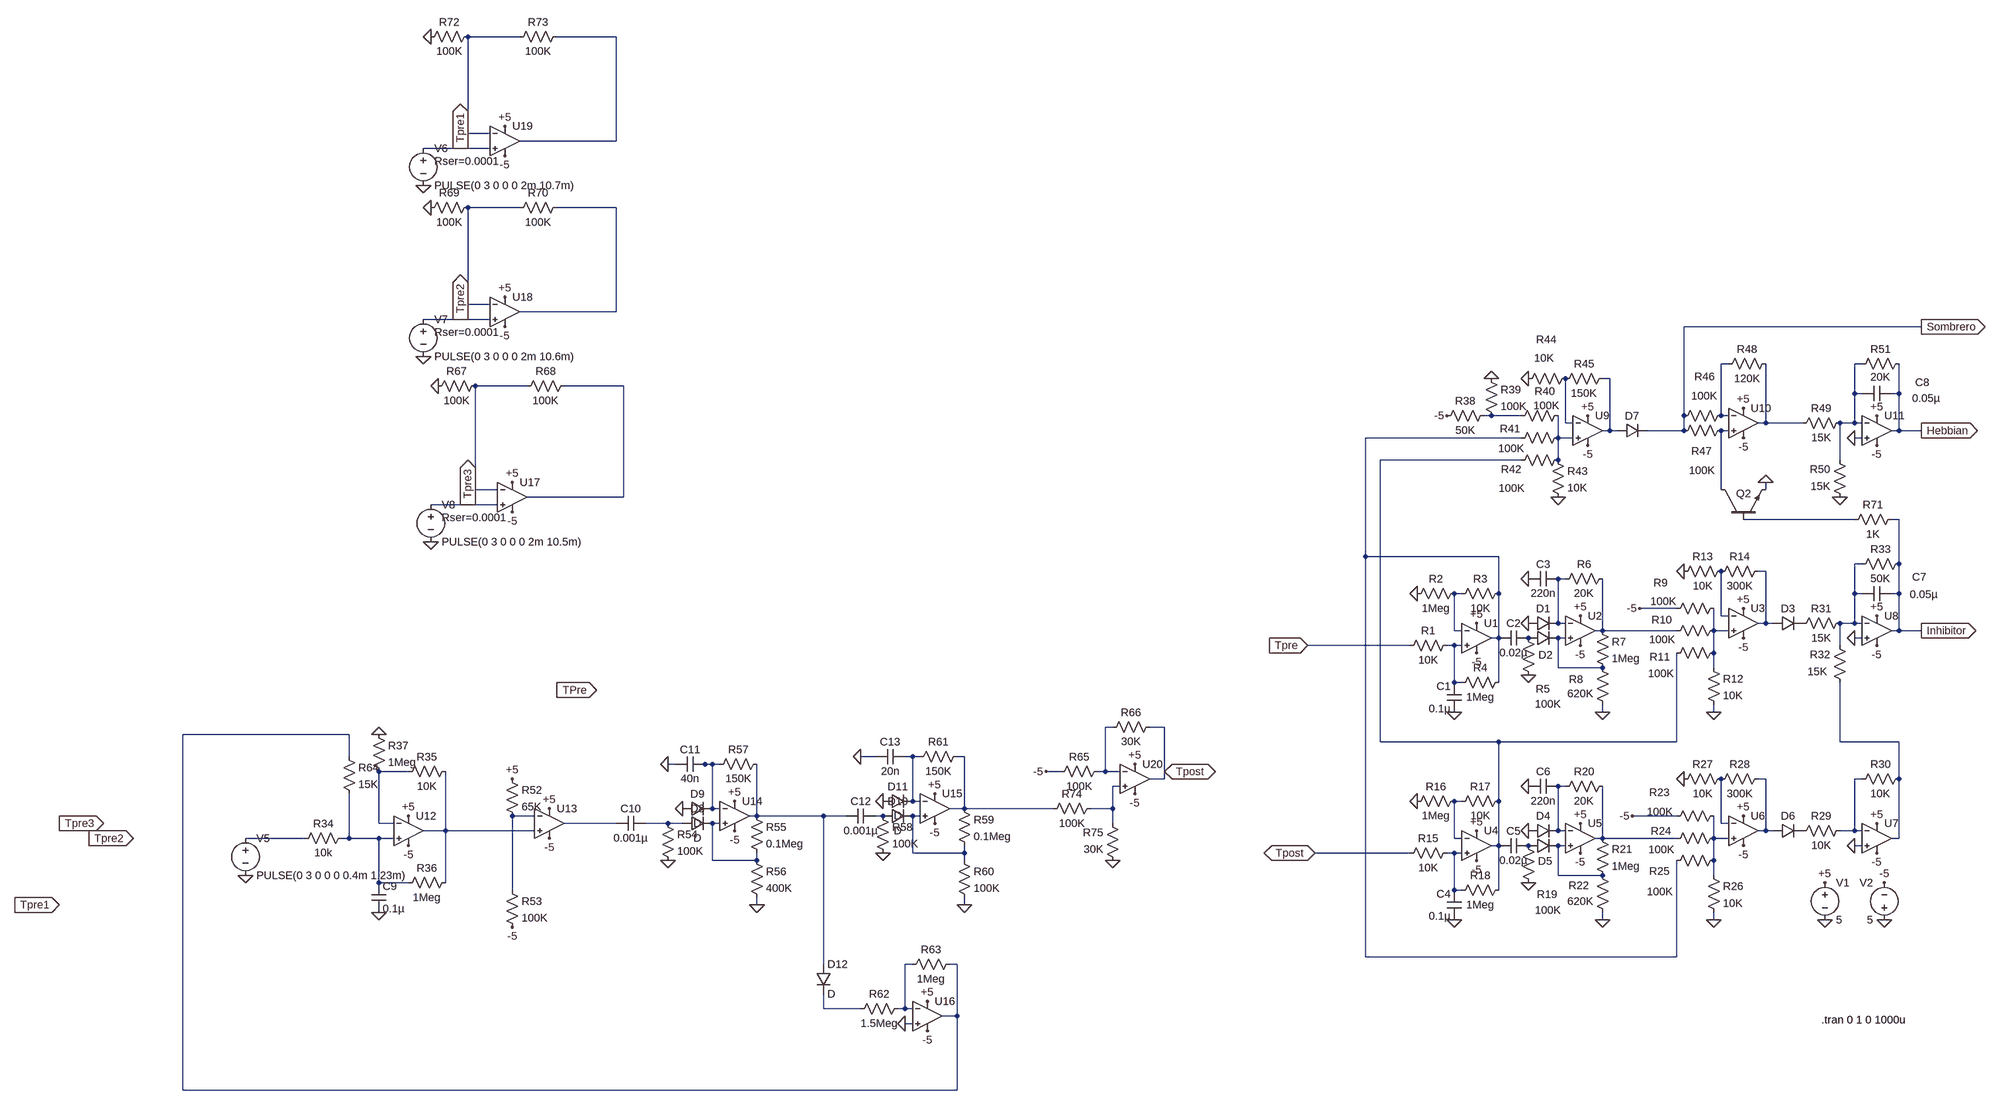
[diagram p0: schematic Stable_operation.asc]
Stable_operation.asc, the LTspice schematic file:
Version 4
SHEET 1 2784 1988
WIRE -2000 -1328 -2112 -1328
WIRE -1792 -1328 -1920 -1328
WIRE -2112 -1104 -2112 -1328
WIRE -2064 -1104 -2112 -1104
WIRE -1792 -1088 -1792 -1328
WIRE -1792 -1088 -2000 -1088
WIRE -2128 -1072 -2208 -1072
WIRE -2064 -1072 -2128 -1072
WIRE -2000 -944 -2112 -944
WIRE -1792 -944 -1920 -944
WIRE -2112 -720 -2112 -944
WIRE -2064 -720 -2112 -720
WIRE -1792 -704 -1792 -944
WIRE -1792 -704 -2000 -704
WIRE -2128 -688 -2208 -688
WIRE -2064 -688 -2128 -688
WIRE 1184 -672 672 -672
WIRE 768 -592 752 -592
WIRE 1056 -592 1040 -592
WIRE 512 -560 496 -560
WIRE -1984 -544 -2096 -544
WIRE -1776 -544 -1904 -544
WIRE 1040 -528 1040 -592
WIRE 1056 -528 1040 -528
WIRE 1136 -528 1136 -592
WIRE 1136 -528 1120 -528
WIRE 256 -480 240 -480
WIRE 320 -480 256 -480
WIRE 672 -480 672 -672
WIRE 752 -480 752 -592
WIRE 768 -480 752 -480
WIRE 416 -464 416 -560
WIRE 432 -464 416 -464
WIRE 848 -464 848 -592
WIRE 848 -464 832 -464
WIRE 928 -464 848 -464
WIRE 1040 -464 1040 -528
WIRE 1040 -464 1008 -464
WIRE 1056 -464 1040 -464
WIRE 512 -448 512 -560
WIRE 512 -448 496 -448
WIRE 528 -448 512 -448
WIRE 672 -448 672 -480
WIRE 672 -448 592 -448
WIRE 768 -448 752 -448
WIRE 1136 -448 1136 -528
WIRE 1136 -448 1120 -448
WIRE 1184 -448 1136 -448
WIRE 320 -432 -16 -432
WIRE 400 -432 400 -480
WIRE 432 -432 400 -432
WIRE 1056 -432 1040 -432
WIRE 320 -384 16 -384
WIRE 400 -384 400 -432
WIRE 1008 -384 1008 -464
WIRE -2096 -320 -2096 -544
WIRE -2048 -320 -2096 -320
WIRE 752 -320 752 -448
WIRE 848 -320 848 -336
WIRE -1776 -304 -1776 -544
WIRE -1776 -304 -1984 -304
WIRE -2112 -288 -2192 -288
WIRE -2048 -288 -2112 -288
WIRE 1040 -256 800 -256
WIRE 1136 -256 1120 -256
WIRE -16 -176 -16 -432
WIRE 272 -176 -16 -176
WIRE 1056 -160 1040 -160
WIRE 1136 -160 1136 -256
WIRE 848 -144 832 -144
WIRE 416 -128 400 -128
WIRE 192 -96 176 -96
WIRE 272 -96 272 -176
WIRE 1040 -96 1040 -160
WIRE 1056 -96 1040 -96
WIRE 1136 -96 1136 -160
WIRE 1136 -96 1120 -96
WIRE 656 -64 576 -64
WIRE 752 -48 752 -144
WIRE 768 -48 752 -48
WIRE 400 -32 400 -128
WIRE 416 -32 400 -32
WIRE 848 -32 848 -144
WIRE 848 -32 832 -32
WIRE 864 -32 848 -32
WIRE 1040 -32 1040 -96
WIRE 1040 -32 1008 -32
WIRE 1056 -32 1040 -32
WIRE 176 -16 176 -96
WIRE 192 -16 176 -16
WIRE 496 -16 496 -128
WIRE 496 -16 480 -16
WIRE 656 -16 496 -16
WIRE 736 -16 736 -64
WIRE 768 -16 736 -16
WIRE 1136 -16 1136 -96
WIRE 1136 -16 1120 -16
WIRE 1184 -16 1136 -16
WIRE 272 0 272 -96
WIRE 272 0 256 0
WIRE 416 0 400 0
WIRE 1056 0 1040 0
WIRE 80 16 -224 16
WIRE 176 16 160 16
WIRE 192 16 176 16
WIRE 1008 16 1008 -32
WIRE 736 32 736 -16
WIRE 400 64 400 0
WIRE 496 64 400 64
WIRE 736 64 736 32
WIRE 176 96 176 16
WIRE 192 96 176 96
WIRE 272 96 272 0
WIRE 496 160 496 144
WIRE 736 160 736 144
WIRE -720 192 -736 192
WIRE -608 192 -640 192
WIRE -2368 208 -2736 208
WIRE 16 224 16 -384
WIRE 272 224 16 224
WIRE 656 224 656 32
WIRE 656 224 272 224
WIRE 1008 224 1008 96
WIRE 1136 224 1008 224
WIRE -2368 256 -2368 208
WIRE -1232 256 -1264 256
WIRE -1152 256 -1168 256
WIRE -1136 256 -1152 256
WIRE -1040 256 -1056 256
WIRE -1664 272 -1680 272
WIRE -1600 272 -1616 272
WIRE -1584 272 -1600 272
WIRE -1568 272 -1584 272
WIRE -2240 288 -2304 288
WIRE -832 288 -864 288
WIRE -736 288 -736 192
WIRE -736 288 -752 288
WIRE -704 288 -736 288
WIRE -608 288 -608 192
WIRE -608 304 -608 288
WIRE -608 304 -640 304
WIRE 848 304 832 304
WIRE 1056 304 1040 304
WIRE 1136 304 1136 224
WIRE -704 320 -720 320
WIRE 416 320 400 320
WIRE -1152 352 -1152 256
WIRE -1136 352 -1152 352
WIRE 192 352 176 352
WIRE 272 352 272 224
WIRE -1584 368 -1584 272
WIRE -1568 368 -1584 368
WIRE -1040 368 -1040 256
WIRE -1040 368 -1072 368
WIRE -848 368 -1040 368
WIRE -720 368 -720 320
WIRE -720 368 -768 368
WIRE -1968 384 -2016 384
WIRE -1488 384 -1488 272
WIRE -1488 384 -1504 384
WIRE -1344 384 -1488 384
WIRE -1296 384 -1344 384
WIRE -1216 384 -1232 384
WIRE -1136 384 -1152 384
WIRE 656 384 560 384
WIRE -2304 400 -2304 288
WIRE -2272 400 -2304 400
WIRE -1792 400 -1904 400
WIRE -1680 400 -1728 400
WIRE -1648 400 -1680 400
WIRE -1568 400 -1584 400
WIRE -720 400 -720 368
WIRE 752 400 752 304
WIRE 768 400 752 400
WIRE -2160 416 -2160 288
WIRE -2160 416 -2208 416
WIRE -1968 416 -2160 416
WIRE 400 416 400 320
WIRE 416 416 400 416
WIRE 848 416 848 304
WIRE 848 416 832 416
WIRE 864 416 848 416
WIRE 1040 416 1040 304
WIRE 1040 416 1008 416
WIRE 1056 416 1040 416
WIRE -2464 432 -2592 432
WIRE -2368 432 -2368 336
WIRE -2368 432 -2384 432
WIRE -2304 432 -2368 432
WIRE -2272 432 -2304 432
WIRE 176 432 176 352
WIRE 192 432 176 432
WIRE 496 432 496 320
WIRE 496 432 480 432
WIRE 656 432 496 432
WIRE 736 432 736 384
WIRE 768 432 736 432
WIRE 1136 432 1136 304
WIRE 1136 432 1120 432
WIRE 272 448 272 352
WIRE 272 448 256 448
WIRE 416 448 400 448
WIRE 1056 448 1040 448
WIRE -1152 464 -1152 384
WIRE -1040 464 -1040 448
WIRE -1040 464 -1152 464
WIRE 80 464 -208 464
WIRE 176 464 160 464
WIRE 192 464 176 464
WIRE -1584 480 -1584 400
WIRE -1488 480 -1488 464
WIRE -1488 480 -1584 480
WIRE -1040 480 -1040 464
WIRE 736 480 736 432
WIRE 400 512 400 448
WIRE 496 512 400 512
WIRE 736 512 736 480
WIRE -2304 528 -2304 432
WIRE -2240 528 -2304 528
WIRE -2160 528 -2160 416
WIRE -2016 544 -2016 384
WIRE 176 544 176 464
WIRE 192 544 176 544
WIRE 272 544 272 448
WIRE -1488 576 -1488 560
WIRE -1040 576 -1040 560
WIRE 496 608 496 592
WIRE 736 608 736 592
WIRE -16 688 -16 -176
WIRE 656 688 656 480
WIRE 656 688 -16 688
WIRE -1344 704 -1344 384
WIRE -1152 704 -1168 704
WIRE -1056 704 -1072 704
WIRE -1344 800 -1344 768
WIRE -1264 800 -1344 800
WIRE -1168 800 -1168 704
WIRE -1168 800 -1184 800
WIRE -1152 800 -1168 800
WIRE -1056 816 -1056 704
WIRE -1056 816 -1088 816
WIRE -1152 832 -1168 832
WIRE -2736 976 -2736 208
WIRE -1056 976 -1056 816
WIRE -1056 976 -2736 976
FLAG 800 -64 +5
FLAG 800 0 -5
FLAG 224 -32 +5
FLAG 224 32 -5
FLAG 448 -48 +5
FLAG 448 16 -5
FLAG 336 -32 0
FLAG 336 -128 0
FLAG 336 80 0
FLAG 672 -144 0
FLAG 576 -64 -5
FLAG 448 400 +5
FLAG 448 464 -5
FLAG 336 416 0
FLAG 336 320 0
FLAG 336 528 0
FLAG 496 608 0
FLAG 496 160 0
FLAG 800 384 +5
FLAG 800 448 -5
FLAG 672 304 0
FLAG 560 384 -5
FLAG 176 160 0
FLAG 96 -96 0
FLAG 224 416 +5
FLAG 224 480 -5
FLAG 176 608 0
FLAG 96 352 0
FLAG 1088 -48 +5
FLAG 1088 16 -5
FLAG 1088 400 +5
FLAG 1088 464 -5
FLAG 1040 448 0
FLAG 1040 0 0
FLAG 736 160 0
FLAG 736 608 0
FLAG 1184 -16 Inhibitor
IOPIN 1184 -16 Out
FLAG 464 -480 +5
FLAG 464 -416 -5
FLAG 336 -560 0
FLAG 256 -560 0
FLAG 800 -496 +5
FLAG 800 -432 -5
FLAG 160 -480 -5
FLAG 1088 -480 +5
FLAG 1088 -416 -5
FLAG 1040 -432 0
FLAG 1008 -304 0
FLAG 848 -336 0
FLAG 1184 -448 Hebbian
IOPIN 1184 -448 Out
FLAG 1184 -672 Sombrero
IOPIN 1184 -672 Out
FLAG 976 608 0
FLAG 1104 608 0
FLAG 1104 528 -5
FLAG 976 528 +5
FLAG -208 464 Tpost
IOPIN -208 464 BiDir
FLAG 400 -304 0
FLAG -2304 208 0
FLAG -2304 592 0
FLAG -1680 480 0
FLAG -1488 576 0
FLAG -1680 272 0
FLAG -1648 368 0
FLAG -1216 464 0
FLAG -1040 576 0
FLAG -1264 256 0
FLAG -1216 352 0
FLAG -1168 832 0
FLAG -2592 512 0
FLAG -2240 384 +5
FLAG -1936 368 +5
FLAG -1536 352 +5
FLAG -1104 336 +5
FLAG -1120 784 +5
FLAG -1920 112 TPre
IOPIN -1920 112 Out
FLAG -1936 432 -5
FLAG -2240 448 -5
FLAG -1536 416 -5
FLAG -1104 400 -5
FLAG -1120 848 -5
FLAG -2016 624 -5
FLAG -2016 304 +5
FLAG -2016 -336 +5
FLAG -2016 -272 -5
FLAG -2176 -544 0
FLAG -2112 -288 Tpre3
IOPIN -2112 -288 Out
FLAG -2032 -736 +5
FLAG -2032 -672 -5
FLAG -2192 -944 0
FLAG -2128 -688 Tpre2
IOPIN -2128 -688 Out
FLAG -2032 -1120 +5
FLAG -2032 -1056 -5
FLAG -2192 -1328 0
FLAG -2128 -1072 Tpre1
IOPIN -2128 -1072 Out
FLAG -2864 432 Tpre2
IOPIN -2864 432 In
FLAG -3024 576 Tpre1
IOPIN -3024 576 In
FLAG -2928 400 Tpre3
IOPIN -2928 400 In
FLAG -224 16 Tpre
IOPIN -224 16 In
FLAG -2208 -992 0
FLAG -2208 -608 0
FLAG -2192 -208 0
FLAG -672 272 +5
FLAG -672 336 -5
FLAG -720 480 0
FLAG -608 288 Tpost
IOPIN -608 288 BiDir
FLAG -864 288 -5
SYMBOL Opamps\\UniversalOpamp2 800 -32 R0
SYMATTR InstName U3
SYMBOL res 848 -160 R90
WINDOW 0 0 56 VBottom 2
WINDOW 3 32 56 VTop 2
SYMATTR InstName R14
SYMATTR Value 300K
SYMBOL res 720 48 R0
SYMATTR InstName R12
SYMATTR Value 10K
SYMBOL res 752 -32 R90
WINDOW 0 8 128 VBottom 2
WINDOW 3 20 127 VTop 2
SYMATTR InstName R10
SYMATTR Value 100K
SYMBOL Opamps\\UniversalOpamp2 224 0 R0
SYMATTR InstName U1
SYMBOL cap 192 160 R180
WINDOW 0 24 56 Left 2
WINDOW 3 24 8 Left 2
SYMATTR InstName C1
SYMATTR Value 0.1µ
SYMBOL res 176 0 R90
WINDOW 0 0 56 VBottom 2
WINDOW 3 32 56 VTop 2
SYMATTR InstName R1
SYMATTR Value 10K
SYMBOL res 176 448 R90
WINDOW 0 0 56 VBottom 2
WINDOW 3 32 56 VTop 2
SYMATTR InstName R15
SYMATTR Value 10K
SYMBOL res 288 -112 R90
WINDOW 0 0 56 VBottom 2
WINDOW 3 32 56 VTop 2
SYMATTR InstName R3
SYMATTR Value 10K
SYMBOL res 752 16 R90
WINDOW 0 40 132 VBottom 2
WINDOW 3 45 130 VTop 2
SYMATTR InstName R11
SYMATTR Value 100K
SYMBOL Opamps\\UniversalOpamp2 448 -16 R0
SYMATTR InstName U2
SYMBOL diode 336 -16 R270
WINDOW 0 32 32 VTop 2
WINDOW 3 0 32 Invisible 2
SYMATTR InstName D1
SYMBOL diode 336 16 R270
WINDOW 0 -36 37 VTop 2
WINDOW 3 0 32 Invisible 2
SYMATTR InstName D2
SYMBOL res 480 -32 R0
SYMATTR InstName R7
SYMATTR Value 1Meg
SYMBOL res 512 160 R180
WINDOW 0 58 71 Left 2
WINDOW 3 36 40 Left 2
SYMATTR InstName R8
SYMATTR Value 620K
SYMBOL res 320 -16 R0
WINDOW 0 32 126 Left 2
WINDOW 3 30 158 Left 2
SYMATTR InstName R5
SYMATTR Value 100K
SYMBOL cap 336 -16 R90
WINDOW 0 0 32 VBottom 2
WINDOW 3 32 32 VTop 2
SYMATTR InstName C2
SYMATTR Value 0.02µ
SYMBOL res 512 -144 R90
WINDOW 0 0 56 VBottom 2
WINDOW 3 32 56 VTop 2
SYMATTR InstName R6
SYMATTR Value 20K
SYMBOL cap 400 -144 R90
WINDOW 0 0 32 VBottom 2
WINDOW 3 32 32 VTop 2
SYMATTR InstName C3
SYMATTR Value 220n
SYMBOL res 656 -128 R270
WINDOW 0 32 56 VTop 2
WINDOW 3 0 56 VBottom 2
SYMATTR InstName R13
SYMATTR Value 10K
SYMBOL diode 864 -16 R270
WINDOW 0 32 32 VTop 2
WINDOW 3 0 32 Invisible 2
SYMATTR InstName D3
SYMBOL res 752 -80 R90
WINDOW 0 -24 131 VBottom 2
WINDOW 3 -15 125 VTop 2
SYMATTR InstName R9
SYMATTR Value 100K
SYMBOL Opamps\\UniversalOpamp2 448 432 R0
SYMATTR InstName U5
SYMBOL diode 336 432 R270
WINDOW 0 32 32 VTop 2
WINDOW 3 0 32 Invisible 2
SYMATTR InstName D4
SYMBOL diode 336 464 R270
WINDOW 0 -33 36 VTop 2
WINDOW 3 0 32 Invisible 2
SYMATTR InstName D5
SYMBOL res 480 416 R0
SYMATTR InstName R21
SYMATTR Value 1Meg
SYMBOL res 512 608 R180
WINDOW 0 45 74 Left 2
WINDOW 3 36 40 Left 2
SYMATTR InstName R22
SYMATTR Value 620K
SYMBOL res 320 432 R0
WINDOW 0 34 121 Left 2
WINDOW 3 30 155 Left 2
SYMATTR InstName R19
SYMATTR Value 100K
SYMBOL res 512 304 R90
WINDOW 0 0 56 VBottom 2
WINDOW 3 32 56 VTop 2
SYMATTR InstName R20
SYMATTR Value 20K
SYMBOL cap 400 304 R90
WINDOW 0 0 32 VBottom 2
WINDOW 3 32 32 VTop 2
SYMATTR InstName C6
SYMATTR Value 220n
SYMBOL cap 336 432 R90
WINDOW 0 0 32 VBottom 2
WINDOW 3 32 32 VTop 2
SYMATTR InstName C5
SYMATTR Value 0.02µ
SYMBOL Opamps\\UniversalOpamp2 800 416 R0
SYMATTR InstName U6
SYMBOL res 848 288 R90
WINDOW 0 0 56 VBottom 2
WINDOW 3 32 56 VTop 2
SYMATTR InstName R28
SYMATTR Value 300K
SYMBOL res 720 496 R0
SYMATTR InstName R26
SYMATTR Value 10K
SYMBOL res 752 416 R90
WINDOW 0 16 130 VBottom 2
WINDOW 3 25 129 VTop 2
SYMATTR InstName R24
SYMATTR Value 100K
SYMBOL res 752 464 R90
WINDOW 0 55 133 VBottom 2
WINDOW 3 68 132 VTop 2
SYMATTR InstName R25
SYMATTR Value 100K
SYMBOL res 656 320 R270
WINDOW 0 32 56 VTop 2
WINDOW 3 0 56 VBottom 2
SYMATTR InstName R27
SYMATTR Value 10K
SYMBOL diode 864 432 R270
WINDOW 0 32 32 VTop 2
WINDOW 3 0 32 Invisible 2
SYMATTR InstName D6
SYMBOL res 752 368 R90
WINDOW 0 -19 133 VBottom 2
WINDOW 3 -9 132 VTop 2
SYMATTR InstName R23
SYMATTR Value 100K
SYMBOL res 1152 -176 R90
WINDOW 0 0 56 VBottom 2
WINDOW 3 32 56 VTop 2
SYMATTR InstName R33
SYMATTR Value 50K
SYMBOL res 1024 -48 R90
WINDOW 0 0 56 VBottom 2
WINDOW 3 32 56 VTop 2
SYMATTR InstName R31
SYMATTR Value 15K
SYMBOL res 1024 112 R180
WINDOW 0 36 76 Left 2
WINDOW 3 43 40 Left 2
SYMATTR InstName R32
SYMATTR Value 15K
SYMBOL res 288 80 R90
WINDOW 0 0 56 VBottom 2
WINDOW 3 32 56 VTop 2
SYMATTR InstName R4
SYMATTR Value 1Meg
SYMBOL res 192 -112 R90
WINDOW 0 0 56 VBottom 2
WINDOW 3 32 56 VTop 2
SYMATTR InstName R2
SYMATTR Value 1Meg
SYMBOL Opamps\\UniversalOpamp2 224 448 R0
SYMATTR InstName U4
SYMBOL cap 192 608 R180
WINDOW 0 24 56 Left 2
WINDOW 3 24 8 Left 2
SYMATTR InstName C4
SYMATTR Value 0.1µ
SYMBOL res 288 336 R90
WINDOW 0 0 56 VBottom 2
WINDOW 3 32 56 VTop 2
SYMATTR InstName R17
SYMATTR Value 10K
SYMBOL res 288 528 R90
WINDOW 0 0 56 VBottom 2
WINDOW 3 32 56 VTop 2
SYMATTR InstName R18
SYMATTR Value 1Meg
SYMBOL res 192 336 R90
WINDOW 0 0 56 VBottom 2
WINDOW 3 32 56 VTop 2
SYMATTR InstName R16
SYMATTR Value 1Meg
SYMBOL Opamps\\UniversalOpamp2 1088 -16 R0
SYMATTR InstName U8
SYMBOL res 1152 288 R90
WINDOW 0 0 56 VBottom 2
WINDOW 3 32 56 VTop 2
SYMATTR InstName R30
SYMATTR Value 10K
SYMBOL Opamps\\UniversalOpamp2 1088 432 R0
SYMATTR InstName U7
SYMBOL res 1024 400 R90
WINDOW 0 0 56 VBottom 2
WINDOW 3 32 56 VTop 2
SYMATTR InstName R29
SYMATTR Value 10K
SYMBOL cap 1120 -112 R90
WINDOW 0 -4 -60 VBottom 2
WINDOW 3 2 -70 VTop 2
SYMATTR InstName C7
SYMATTR Value 0.05µ
SYMBOL Opamps\\UniversalOpamp2 464 -448 R0
SYMATTR InstName U9
SYMBOL res 512 -576 R90
WINDOW 0 0 56 VBottom 2
WINDOW 3 32 56 VTop 2
SYMATTR InstName R45
SYMATTR Value 150K
SYMBOL res 384 -400 R0
SYMATTR InstName R43
SYMATTR Value 10K
SYMBOL res 416 -448 R90
WINDOW 0 12 120 VBottom 2
WINDOW 3 23 117 VTop 2
SYMATTR InstName R41
SYMATTR Value 100K
SYMBOL res 320 -544 R270
WINDOW 0 85 55 VTop 2
WINDOW 3 76 50 VBottom 2
SYMATTR InstName R44
SYMATTR Value 10K
SYMBOL res 416 -496 R90
WINDOW 0 -21 45 VBottom 2
WINDOW 3 -21 41 VTop 2
SYMATTR InstName R40
SYMATTR Value 100K
SYMBOL res 240 -576 R0
SYMATTR InstName R39
SYMATTR Value 100K
SYMBOL res 256 -496 R90
WINDOW 0 0 56 VBottom 2
WINDOW 3 32 56 VTop 2
SYMATTR InstName R38
SYMATTR Value 50K
SYMBOL diode 528 -432 R270
WINDOW 0 32 32 VTop 2
WINDOW 3 0 32 Invisible 2
SYMATTR InstName D7
SYMBOL res 864 -608 R90
WINDOW 0 0 56 VBottom 2
WINDOW 3 32 56 VTop 2
SYMATTR InstName R48
SYMATTR Value 120K
SYMBOL Opamps\\UniversalOpamp2 800 -464 R0
SYMATTR InstName U10
SYMBOL res 768 -496 R90
WINDOW 0 -53 52 VBottom 2
WINDOW 3 -42 52 VTop 2
SYMATTR InstName R46
SYMATTR Value 100K
SYMBOL res 768 -464 R90
WINDOW 0 76 58 VBottom 2
WINDOW 3 87 57 VTop 2
SYMATTR InstName R47
SYMATTR Value 100K
SYMBOL npn 752 -256 R270
WINDOW 0 56 32 VRight 2
WINDOW 3 56 68 Invisible 2
SYMATTR InstName Q2
SYMBOL res 1152 -608 R90
WINDOW 0 0 56 VBottom 2
WINDOW 3 60 56 VBottom 2
SYMATTR InstName R51
SYMATTR Value 20K
SYMBOL res 1024 -480 R90
WINDOW 0 0 56 VBottom 2
WINDOW 3 32 56 VTop 2
SYMATTR InstName R49
SYMATTR Value 15K
SYMBOL res 1024 -288 R180
WINDOW 0 36 76 Left 2
WINDOW 3 36 40 Left 2
SYMATTR InstName R50
SYMATTR Value 15K
SYMBOL Opamps\\UniversalOpamp2 1088 -448 R0
SYMATTR InstName U11
SYMBOL cap 1120 -544 R90
WINDOW 0 8 -66 VBottom 2
WINDOW 3 11 -75 VTop 2
SYMATTR InstName C8
SYMATTR Value 0.05µ
SYMBOL res 1024 -240 R270
WINDOW 0 32 56 VTop 2
WINDOW 3 0 56 VBottom 2
SYMATTR InstName R71
SYMATTR Value 1K
SYMBOL voltage 976 512 R0
WINDOW 123 0 0 Left 2
WINDOW 39 0 0 Left 2
SYMATTR InstName V1
SYMATTR Value 5
SYMBOL voltage 1104 624 R180
WINDOW 0 24 96 Left 2
WINDOW 3 24 16 Left 2
WINDOW 123 0 0 Left 2
WINDOW 39 0 0 Left 2
SYMATTR InstName V2
SYMATTR Value 5
SYMBOL res 416 -400 R90
WINDOW 0 51 117 VBottom 2
WINDOW 3 61 116 VTop 2
SYMATTR InstName R42
SYMATTR Value 100K
SYMBOL voltage -2592 416 R0
WINDOW 123 0 0 Left 0
WINDOW 39 0 0 Left 0
SYMATTR InstName V5
SYMATTR Value PULSE(0 3 0 0 0 0.4m 1.23m)
SYMBOL Opamps\\UniversalOpamp2 -2240 416 R0
SYMATTR InstName U12
SYMBOL res -2144 272 R90
WINDOW 0 0 56 VBottom 2
WINDOW 3 32 56 VTop 2
SYMATTR InstName R35
SYMATTR Value 10K
SYMBOL res -2144 512 R90
WINDOW 0 0 56 VBottom 2
WINDOW 3 32 56 VTop 2
SYMATTR InstName R36
SYMATTR Value 1Meg
SYMBOL res -2320 192 R0
SYMATTR InstName R37
SYMATTR Value 1Meg
SYMBOL cap -2320 528 R0
SYMATTR InstName C9
SYMATTR Value 0.1µ
SYMBOL Opamps\\UniversalOpamp2 -1936 400 R0
SYMATTR InstName U13
SYMBOL res -2032 288 R0
SYMATTR InstName R52
SYMATTR Value 65K
SYMBOL res -2032 528 R0
SYMATTR InstName R53
SYMATTR Value 100K
SYMBOL cap -1728 384 R90
WINDOW 0 0 32 VBottom 2
WINDOW 3 32 32 VTop 2
SYMATTR InstName C10
SYMATTR Value 0.001µ
SYMBOL res -1696 384 R0
SYMATTR InstName R54
SYMATTR Value 100K
SYMBOL diode -1648 416 R270
WINDOW 0 32 32 VTop 2
WINDOW 3 0 32 VBottom 2
SYMATTR InstName D8
SYMBOL Opamps\\UniversalOpamp2 -1536 384 R0
SYMATTR InstName U14
SYMBOL res -1504 368 R0
SYMATTR InstName R55
SYMATTR Value 0.1Meg
SYMBOL res -1504 464 R0
SYMATTR InstName R56
SYMATTR Value 400K
SYMBOL res -1472 256 R90
WINDOW 0 0 56 VBottom 2
WINDOW 3 32 56 VTop 2
SYMATTR InstName R57
SYMATTR Value 150K
SYMBOL cap -1600 256 R90
WINDOW 0 0 32 VBottom 2
WINDOW 3 32 32 VTop 2
SYMATTR InstName C11
SYMATTR Value 40n
SYMBOL diode -1648 384 R270
WINDOW 0 32 32 VTop 2
WINDOW 3 0 32 VBottom 2
SYMATTR InstName D9
SYMBOL cap -1232 368 R90
WINDOW 0 0 32 VBottom 2
WINDOW 3 32 32 VTop 2
SYMATTR InstName C12
SYMATTR Value 0.001µ
SYMBOL diode -1216 400 R270
WINDOW 0 32 32 VTop 2
WINDOW 3 0 32 VBottom 2
SYMATTR InstName D10
SYMBOL res -1232 368 R0
SYMATTR InstName R58
SYMATTR Value 100K
SYMBOL Opamps\\UniversalOpamp2 -1104 368 R0
SYMATTR InstName U15
SYMBOL res -1056 352 R0
SYMATTR InstName R59
SYMATTR Value 0.1Meg
SYMBOL res -1056 464 R0
SYMATTR InstName R60
SYMATTR Value 100K
SYMBOL res -1040 240 R90
WINDOW 0 0 56 VBottom 2
WINDOW 3 32 56 VTop 2
SYMATTR InstName R61
SYMATTR Value 150K
SYMBOL cap -1168 240 R90
WINDOW 0 0 32 VBottom 2
WINDOW 3 32 32 VTop 2
SYMATTR InstName C13
SYMATTR Value 20n
SYMBOL diode -1216 368 R270
WINDOW 0 32 32 VTop 2
WINDOW 3 0 32 VBottom 2
SYMATTR InstName D11
SYMBOL diode -1360 704 R0
SYMATTR InstName D12
SYMBOL res -1168 784 R90
WINDOW 0 0 56 VBottom 2
WINDOW 3 32 56 VTop 2
SYMATTR InstName R62
SYMATTR Value 1.5Meg
SYMBOL Opamps\\UniversalOpamp2 -1120 816 R0
SYMATTR InstName U16
SYMBOL res -1056 688 R90
WINDOW 0 0 56 VBottom 2
WINDOW 3 32 56 VTop 2
SYMATTR InstName R63
SYMATTR Value 1Meg
SYMBOL res -2384 240 R0
SYMATTR InstName R64
SYMATTR Value 15K
SYMBOL Opamps\\UniversalOpamp2 -2016 -304 R0
SYMATTR InstName U17
SYMBOL res -2080 -560 R90
WINDOW 0 0 56 VBottom 2
WINDOW 3 32 56 VTop 2
SYMATTR InstName R67
SYMATTR Value 100K
SYMBOL res -1888 -560 R90
WINDOW 0 0 56 VBottom 2
WINDOW 3 32 56 VTop 2
SYMATTR InstName R68
SYMATTR Value 100K
SYMBOL Opamps\\UniversalOpamp2 -2032 -704 R0
SYMATTR InstName U18
SYMBOL res -2096 -960 R90
WINDOW 0 0 56 VBottom 2
WINDOW 3 32 56 VTop 2
SYMATTR InstName R69
SYMATTR Value 100K
SYMBOL res -1904 -960 R90
WINDOW 0 0 56 VBottom 2
WINDOW 3 32 56 VTop 2
SYMATTR InstName R70
SYMATTR Value 100K
SYMBOL Opamps\\UniversalOpamp2 -2032 -1088 R0
SYMATTR InstName U19
SYMBOL res -2096 -1344 R90
WINDOW 0 0 56 VBottom 2
WINDOW 3 32 56 VTop 2
SYMATTR InstName R72
SYMATTR Value 100K
SYMBOL res -1904 -1344 R90
WINDOW 0 0 56 VBottom 2
WINDOW 3 32 56 VTop 2
SYMATTR InstName R73
SYMATTR Value 100K
SYMBOL voltage -2208 -1088 R0
WINDOW 123 0 0 Left 0
WINDOW 39 24 44 Left 2
SYMATTR SpiceLine Rser=0.0001
SYMATTR InstName V6
SYMATTR Value PULSE(0 3 0 0 0 2m 10.7m)
SYMBOL voltage -2208 -704 R0
WINDOW 123 0 0 Left 0
WINDOW 39 24 44 Left 2
SYMATTR SpiceLine Rser=0.0001
SYMATTR InstName V7
SYMATTR Value PULSE(0 3 0 0 0 2m 10.6m)
SYMBOL voltage -2192 -304 R0
WINDOW 123 0 0 Left 0
WINDOW 39 24 44 Left 2
SYMATTR SpiceLine Rser=0.0001
SYMATTR InstName V8
SYMATTR Value PULSE(0 3 0 0 0 2m 10.5m)
SYMBOL res -2368 416 R90
WINDOW 0 0 56 VBottom 2
WINDOW 3 32 56 VTop 2
SYMATTR InstName R34
SYMATTR Value 10k
SYMBOL Opamps\\UniversalOpamp2 -672 304 R0
SYMATTR InstName U20
SYMBOL res -736 272 R90
WINDOW 0 0 56 VBottom 2
WINDOW 3 32 56 VTop 2
SYMATTR InstName R65
SYMATTR Value 100K
SYMBOL res -624 176 R90
WINDOW 0 0 56 VBottom 2
WINDOW 3 32 56 VTop 2
SYMATTR InstName R66
SYMATTR Value 30K
SYMBOL res -752 352 R90
WINDOW 0 0 56 VBottom 2
WINDOW 3 32 56 VTop 2
SYMATTR InstName R74
SYMATTR Value 100K
SYMBOL res -704 496 R180
WINDOW 0 36 76 Left 2
WINDOW 3 36 40 Left 2
SYMATTR InstName R75
SYMATTR Value 30K
TEXT 968 824 Left 2 !.tran 0 1 0 1000u

The netlist it stands for:
* Stable_operation.asc
XU3 N024 N022 +5 -5 N019 level.2 Avol=1Meg GBW=10Meg Slew=10Meg ilimit=25m rail=0 Vos=0 phimargin=45 en=0 enk=0 in=0 ink=0 Rin=500Meg  ; pins IN+ IN- V+ V- OUT
R14 N019 N022 300K
R12 N024 0 10K
R10 N024 N023 100K
XU1 N026 N021 +5 -5 N014 level.2 Avol=1Meg GBW=10Meg Slew=10Meg ilimit=25m rail=0 Vos=0 phimargin=45 en=0 enk=0 in=0 ink=0 Rin=500Meg  ; pins IN+ IN- V+ V- OUT
C1 0 N026 0.1µ
R1 N026 TPre 10K
R15 N053 Tpost 10K
R3 N014 N021 10K
R11 N024 N016 100K
XU2 N025 N020 +5 -5 N023 level.2 Avol=1Meg GBW=10Meg Slew=10Meg ilimit=25m rail=0 Vos=0 phimargin=45 en=0 enk=0 in=0 ink=0 Rin=500Meg  ; pins IN+ IN- V+ V- OUT
D1 0 N020 D
D2 P001 N025 D
R7 N023 N025 1Meg
R8 0 N025 620K
R5 P001 0 100K
C2 P001 N014 0.02µ
R6 N023 N020 20K
C3 N020 0 220n
R13 0 N022 10K
D3 N019 P002 D
R9 N024 -5 100K
XU5 N052 N037 +5 -5 N050 level.2 Avol=1Meg GBW=10Meg Slew=10Meg ilimit=25m rail=0 Vos=0 phimargin=45 en=0 enk=0 in=0 ink=0 Rin=500Meg  ; pins IN+ IN- V+ V- OUT
D4 0 N037 D
D5 P003 N052 D
R21 N050 N052 1Meg
R22 0 N052 620K
R19 P003 0 100K
R20 N050 N037 20K
C6 N037 0 220n
C5 P003 N016 0.02µ
XU6 N051 N046 +5 -5 N034 level.2 Avol=1Meg GBW=10Meg Slew=10Meg ilimit=25m rail=0 Vos=0 phimargin=45 en=0 enk=0 in=0 ink=0 Rin=500Meg  ; pins IN+ IN- V+ V- OUT
R28 N034 N046 300K
R26 N051 0 10K
R24 N051 N050 100K
R25 N051 N014 100K
R27 0 N046 10K
D6 N034 P004 D
R23 N051 -5 100K
R33 Inhibitor N018 50K
R31 N018 P002 15K
R32 N029 N018 15K
R4 N014 N026 1Meg
R2 N021 0 1Meg
XU4 N053 N038 +5 -5 N016 level.2 Avol=1Meg GBW=10Meg Slew=10Meg ilimit=25m rail=0 Vos=0 phimargin=45 en=0 enk=0 in=0 ink=0 Rin=500Meg  ; pins IN+ IN- V+ V- OUT
C4 0 N053 0.1µ
R17 N016 N038 10K
R18 N016 N053 1Meg
R16 N038 0 1Meg
XU8 0 N018 +5 -5 Inhibitor level.2 Avol=1Meg GBW=10Meg Slew=10Meg ilimit=25m rail=0 Vos=0 phimargin=45 en=0 enk=0 in=0 ink=0 Rin=500Meg  ; pins IN+ IN- V+ V- OUT
R30 N029 N035 10K
XU7 0 N035 +5 -5 N029 level.2 Avol=1Meg GBW=10Meg Slew=10Meg ilimit=25m rail=0 Vos=0 phimargin=45 en=0 enk=0 in=0 ink=0 Rin=500Meg  ; pins IN+ IN- V+ V- OUT
R29 N035 P004 10K
C7 Inhibitor N018 0.05µ
XU9 N015 N011 +5 -5 N007 level.2 Avol=1Meg GBW=10Meg Slew=10Meg ilimit=25m rail=0 Vos=0 phimargin=45 en=0 enk=0 in=0 ink=0 Rin=500Meg  ; pins IN+ IN- V+ V- OUT
R45 N007 N011 150K
R43 N015 0 10K
R41 N015 N014 100K
R44 0 N011 10K
R40 N015 N010 100K
R39 0 N010 100K
R38 N010 -5 50K
D7 N007 Sombrero D
R48 N012 N005 120K
XU10 N013 N005 +5 -5 N012 level.2 Avol=1Meg GBW=10Meg Slew=10Meg ilimit=25m rail=0 Vos=0 phimargin=45 en=0 enk=0 in=0 ink=0 Rin=500Meg  ; pins IN+ IN- V+ V- OUT
R46 N005 Sombrero 100K
R47 N013 Sombrero 100K
Q2 N013 N017 0 0 NPN
R51 Hebbian N006 20K
R49 N006 N012 15K
R50 0 N006 15K
XU11 0 N006 +5 -5 Hebbian level.2 Avol=1Meg GBW=10Meg Slew=10Meg ilimit=25m rail=0 Vos=0 phimargin=45 en=0 enk=0 in=0 ink=0 Rin=500Meg  ; pins IN+ IN- V+ V- OUT
C8 Hebbian N006 0.05µ
R71 N017 Inhibitor 1K
V1 +5 0 5
V2 0 -5 5
R42 N015 N016 100K
V5 N048 0 PULSE(0 3 0 0 0 0.4m 1.23m)
XU12 N049 N033 +5 -5 N047 level.2 Avol=1Meg GBW=10Meg Slew=10Meg ilimit=25m rail=0 Vos=0 phimargin=45 en=0 enk=0 in=0 ink=0 Rin=500Meg  ; pins IN+ IN- V+ V- OUT
R35 N047 N033 10K
R36 N047 N049 1Meg
R37 0 N033 1Meg
C9 N049 0 0.1µ
XU13 N047 N039 +5 -5 N043 level.2 Avol=1Meg GBW=10Meg Slew=10Meg ilimit=25m rail=0 Vos=0 phimargin=45 en=0 enk=0 in=0 ink=0 Rin=500Meg  ; pins IN+ IN- V+ V- OUT
R52 +5 N039 65K
R53 N039 -5 100K
C10 N044 N043 0.001µ
R54 N044 0 100K
D8 N044 N045 D
XU14 N045 N032 +5 -5 N040 level.2 Avol=1Meg GBW=10Meg Slew=10Meg ilimit=25m rail=0 Vos=0 phimargin=45 en=0 enk=0 in=0 ink=0 Rin=500Meg  ; pins IN+ IN- V+ V- OUT
R55 N040 N045 0.1Meg
R56 N045 0 400K
R57 N040 N032 150K
C11 N032 0 40n
D9 0 N032 D
C12 N041 N040 0.001µ
D10 N041 N042 D
R58 N041 0 100K
XU15 N042 N030 +5 -5 N031 level.2 Avol=1Meg GBW=10Meg Slew=10Meg ilimit=25m rail=0 Vos=0 phimargin=45 en=0 enk=0 in=0 ink=0 Rin=500Meg  ; pins IN+ IN- V+ V- OUT
R59 N031 N042 0.1Meg
R60 N042 0 100K
R61 N031 N030 150K
C13 N030 0 20n
D11 0 N030 D
D12 N040 N055 D
R62 N054 N055 1.5Meg
XU16 0 N054 +5 -5 N028 level.2 Avol=1Meg GBW=10Meg Slew=10Meg ilimit=25m rail=0 Vos=0 phimargin=45 en=0 enk=0 in=0 ink=0 Rin=500Meg  ; pins IN+ IN- V+ V- OUT
R63 N028 N054 1Meg
R64 N028 N049 15K
XU17 Tpre3 N008 +5 -5 N009 level.2 Avol=1Meg GBW=10Meg Slew=10Meg ilimit=25m rail=0 Vos=0 phimargin=45 en=0 enk=0 in=0 ink=0 Rin=500Meg  ; pins IN+ IN- V+ V- OUT
R67 N008 0 100K
R68 N009 N008 100K
XU18 Tpre2 N003 +5 -5 N004 level.2 Avol=1Meg GBW=10Meg Slew=10Meg ilimit=25m rail=0 Vos=0 phimargin=45 en=0 enk=0 in=0 ink=0 Rin=500Meg  ; pins IN+ IN- V+ V- OUT
R69 N003 0 100K
R70 N004 N003 100K
XU19 Tpre1 N001 +5 -5 N002 level.2 Avol=1Meg GBW=10Meg Slew=10Meg ilimit=25m rail=0 Vos=0 phimargin=45 en=0 enk=0 in=0 ink=0 Rin=500Meg  ; pins IN+ IN- V+ V- OUT
R72 N001 0 100K
R73 N002 N001 100K
V6 Tpre1 0 PULSE(0 3 0 0 0 2m 10.7m) Rser=0.0001
V7 Tpre2 0 PULSE(0 3 0 0 0 2m 10.6m) Rser=0.0001
V8 Tpre3 0 PULSE(0 3 0 0 0 2m 10.5m) Rser=0.0001
R34 N049 N048 10k
XU20 N036 N027 +5 -5 Tpost level.2 Avol=1Meg GBW=10Meg Slew=10Meg ilimit=25m rail=0 Vos=0 phimargin=45 en=0 enk=0 in=0 ink=0 Rin=500Meg  ; pins IN+ IN- V+ V- OUT
R65 N027 -5 100K
R66 Tpost N027 30K
R74 N036 N031 100K
R75 0 N036 30K
.model D D
.lib standard.dio
.model NPN NPN
.model PNP PNP
.lib standard.bjt
.tran 0 1 0 1000u
.lib UniversalOpamps2.sub
.backanno
.end